# EAGLE design custom PCB rev2 (EAGLE 9.2.0)
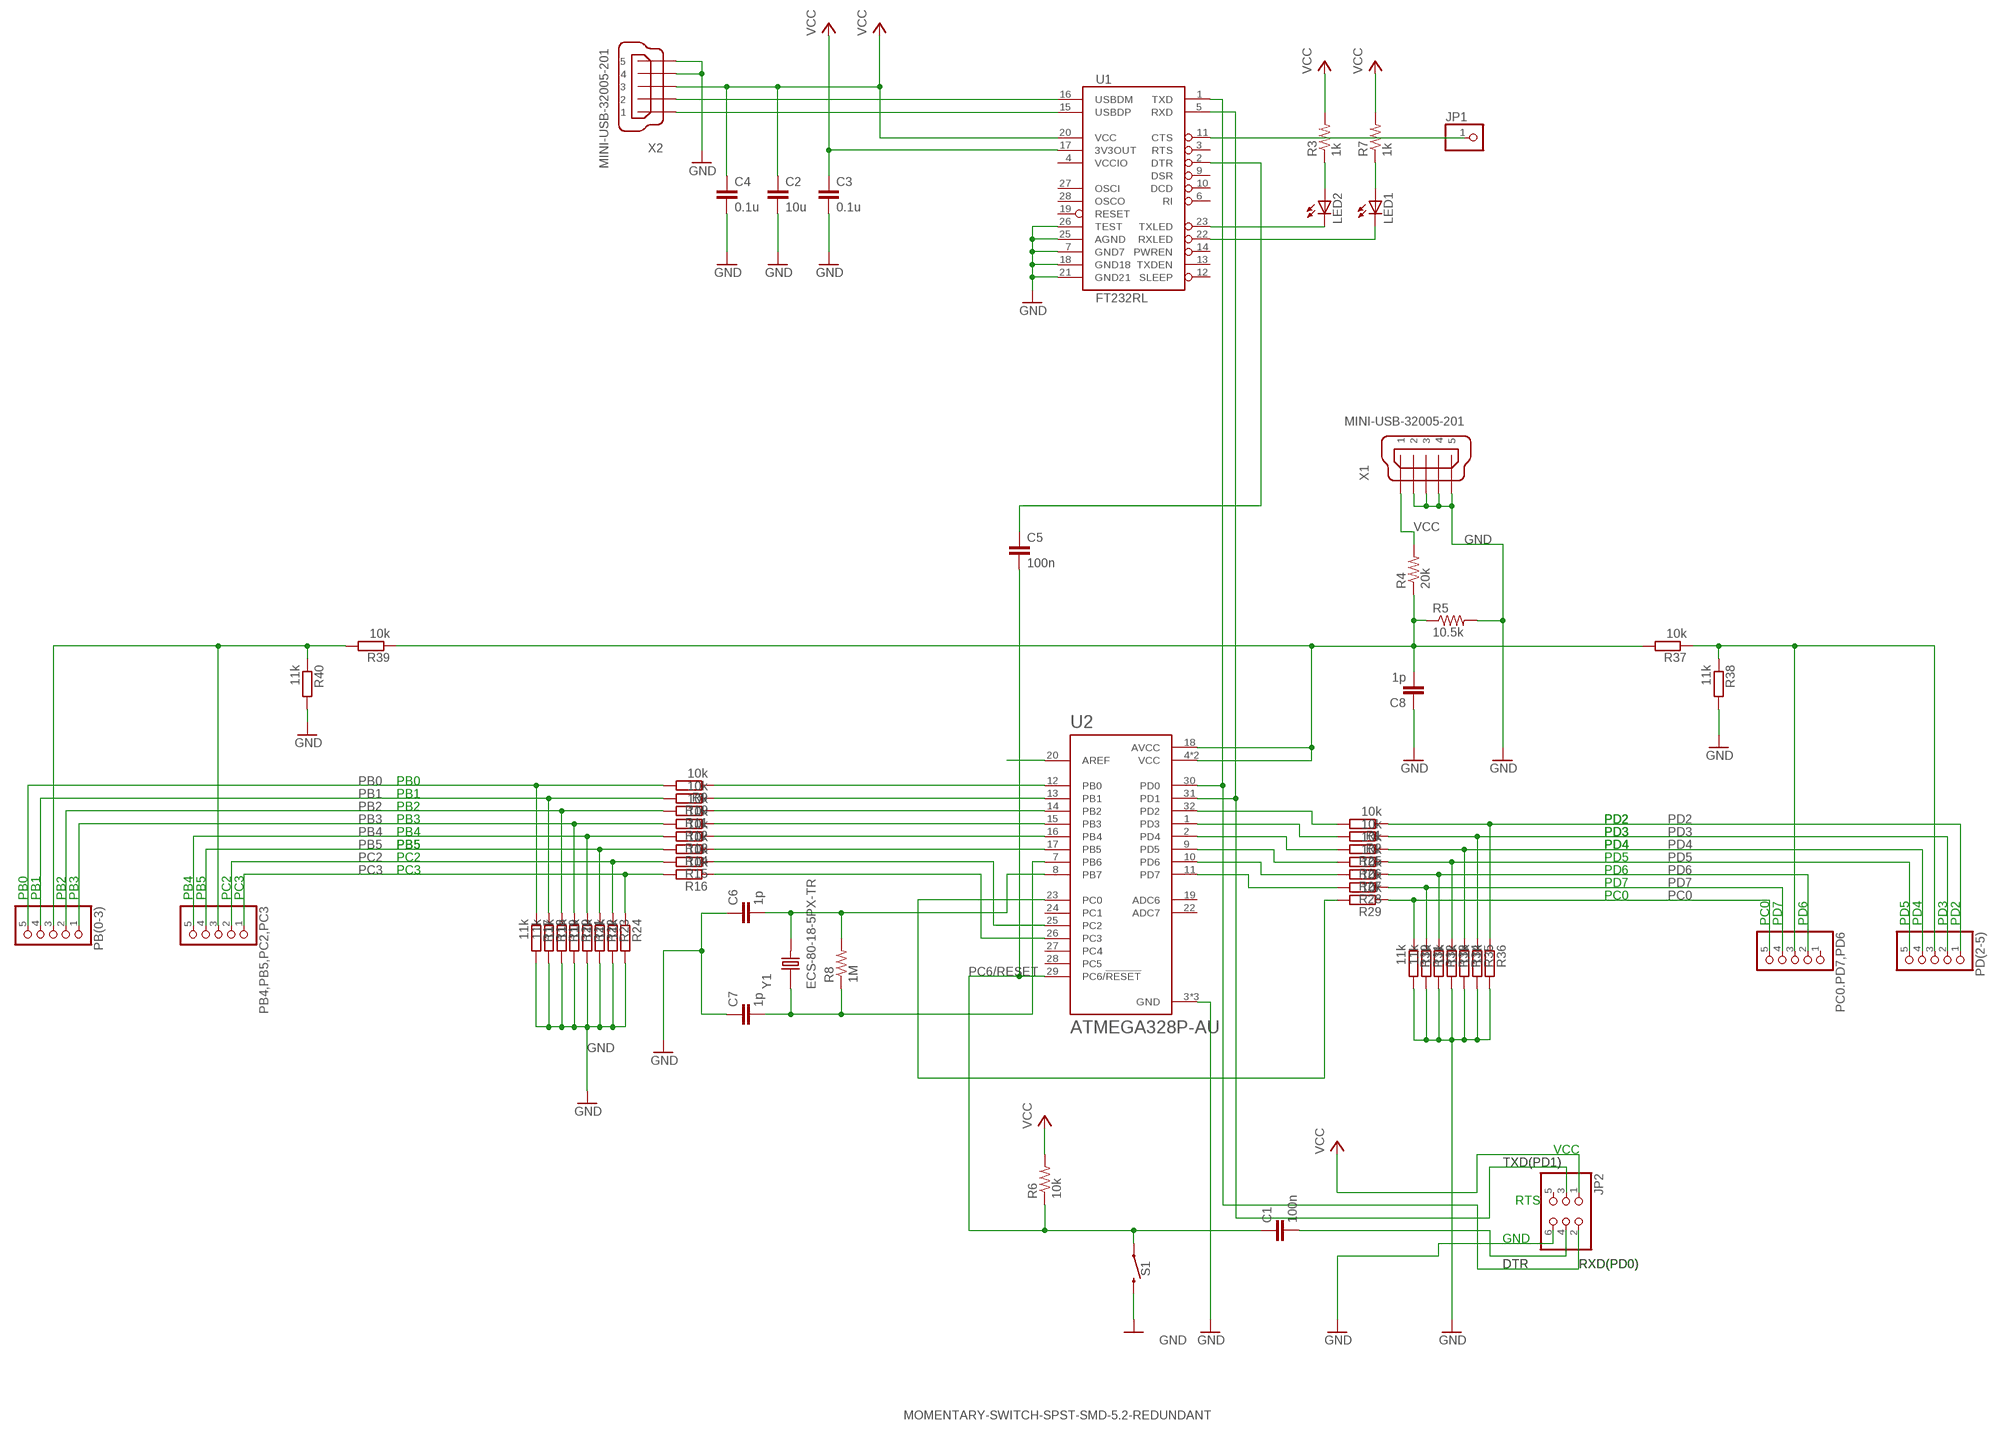
[diagram p0: schematic, sheet 1]

## Parts
C1  100n  C-EUC0603K  [C0603K]
C2  10u  C-EUC0603K  [C0603K]
C3  0.1u  C-EUC0603K  [C0603K]
C4  0.1u  C-EUC0603K  [C0603K]
C5  100n  C-EUC0603K  [C0603K]
C6  1p  C-EUC0603K  [C0603K]
C7  1p  C-EUC0603K  [C0603K]
C8  1p  C-EUC0603K  [C0603K]
JP1  PINHD-1X1  [1X01]
JP2  PINHD-2X3  [2X03]
LED1  LEDCHIP-LED0603  [CHIP-LED0603]
LED2  LEDCHIP-LED0603  [CHIP-LED0603]
PB4,PB5,PC2,PC3  PINHD-1X5  [1X05]
PB(0-3)  PINHD-1X5  [1X05]
PC0.PD7,PD6  PINHD-1X5  [1X05]
PD(2-5)  PINHD-1X5  [1X05]
R1  10k  RR0402  [R0402]
R2  10k  RR0402  [R0402]
R3  1k  R-US_R0603  [R0603]
R4  20k  R-US_R0603  [R0603]
R5  10.5k  R-US_R0603  [R0603]
R6  10k  R-US_R0603  [R0603]
R7  1k  R-US_R0603  [R0603]
R8  1M  R-US_R0603  [R0603]
R9  10k  RR0402  [R0402]
R10  10k  RR0402  [R0402]
R11  10k  RR0402  [R0402]
R12  10k  RR0402  [R0402]
R13  10k  RR0402  [R0402]
R14  10k  RR0402  [R0402]
R15  10k  RR0402  [R0402]
R16  10k  RR0402  [R0402]
R17  11k  RR0402  [R0402]
R18  11k  RR0402  [R0402]
R19  11k  RR0402  [R0402]
R20  11k  RR0402  [R0402]
R21  11k  RR0402  [R0402]
R22  11k  RR0402  [R0402]
R23  11k  RR0402  [R0402]
R24  11k  RR0402  [R0402]
R25  10k  RR0402  [R0402]
R26  10k  RR0402  [R0402]
R27  10k  RR0402  [R0402]
R28  10k  RR0402  [R0402]
R29  10k  RR0402  [R0402]
R30  11k  RR0402  [R0402]
R31  11k  RR0402  [R0402]
R32  11k  RR0402  [R0402]
R33  11k  RR0402  [R0402]
R34  11k  RR0402  [R0402]
R35  11k  RR0402  [R0402]
R36  11k  RR0402  [R0402]
R37  10k  RR0402  [R0402]
R38  11k  RR0402  [R0402]
R39  10k  RR0402  [R0402]
R40  11k  RR0402  [R0402]
S1  MOMENTARY-SWITCH-SPST-SMD-5.2-REDUNDANT  [TACTILE_SWITCH_SMD_5.2MM]
U1  FT232RL  FT232RLSSOP  [SSOP28DB]
U2  ATMEGA328P-AU  [QFP80P900X900X120-32N]
X1  MINI-USB-32005-201  [32005-201]
X2  MINI-USB-32005-201  [32005-201]
Y1  ECS-80-18-5PX-TR  [XTAL_ECS-80-18-5PX-TR]

## Nets
DTR: C1.2 JP2.4
GND: C2.2 C3.2 C4.2 C8.1 JP2.6 R5.2 R17.2 R18.2 R19.2 R20.2 R21.2 R22.2 R23.2 R24.2 R30.2 R31.2 R32.2 R33.2 R34.2 R35.2 R36.2 R38.2 R40.2 S1.3 S1.4 U1.7(GND7) U1.18(GND18) U1.21(GND21) U1.25(AGND) U1.26(TEST) U2.3(GND) U2.5(GND) U2.21(GND) X1.2 X1.3 X1.4 X1.5 X2.4 X2.5
N$1: R9.1 U2.12(PB0)
N$2: R10.1 U2.13(PB1)
N$3: R11.1 U2.14(PB2)
N$4: R12.1 U2.15(PB3)
N$5: R13.1 U2.16(PB4)
N$6: R14.1 U2.17(PB5)
N$7: R15.1 U2.25(PC2)
N$8: R16.1 U2.26(PC3)
N$9: PC0.PD7,PD6.3 PD(2-5).3 R37.1 R38.1
N$10: PB4,PB5,PC2,PC3.3 PB(0-3).3 R39.2 R40.1
N$11: JP1.1 U1.11(CTS)
N$17: R1.2 U2.32(PD2)
N$18: R2.2 U2.1(PD3)
N$19: R25.2 U2.2(PD4)
N$20: R26.2 U2.9(PD5)
N$21: R27.2 U2.10(PD6)
N$22: R28.2 U2.11(PD7)
N$23: R29.2 U2.23(PC0)
N$34: C8.2 R4.1 R5.1 R37.2 R39.1 U2.4(VCC) U2.6(VCC) U2.18(AVCC)
N$36: U2.20(AREF)
N$37: U1.15(USBDP) X2.1
N$38: U1.16(USBDM) X2.2
N$39: LED2.A R3.1
N$40: LED1.A R7.1
N$41: LED2.C U1.23(TXLED)
N$42: LED1.C U1.22(RXLED)
N$43: C6.2 R8.2 U2.8(PB7) Y1.2
N$44: C7.2 R8.1 U2.7(PB6) Y1.1
N$45: C5.1 U1.2(DTR)
N$46: C6.1 C7.1 ; supply symbol labelled GND
PB0: PB(0-3).5 R9.2 R17.1
PB1: PB(0-3).4 R10.2 R18.1
PB2: PB(0-3).2 R11.2 R19.1
PB3: PB(0-3).1 R12.2 R20.1
PB4: PB4,PB5,PC2,PC3.5 R13.2 R21.1
PB5: PB4,PB5,PC2,PC3.4 R14.2 R22.1
PC0: PC0.PD7,PD6.5 R29.1 R30.1
PC2: PB4,PB5,PC2,PC3.2 R15.2 R23.1
PC3: PB4,PB5,PC2,PC3.1 R16.2 R24.1
PC6/RESET: C1.1 C5.2 R6.1 S1.1 S1.2 U2.29(PC6/!RESET)
PD2: PD(2-5).1 R1.1 R36.1
PD3: PD(2-5).2 R2.1 R35.1
PD4: PD(2-5).4 R25.1 R34.1
PD5: PD(2-5).5 R26.1 R33.1
PD6: PC0.PD7,PD6.2 R27.1 R32.1
PD7: PC0.PD7,PD6.4 R28.1 R31.1
RXD(PD0): JP2.2 U1.1(TXD) U2.30(PD0)
TXD(PD1): JP2.3 U1.5(RXD) U2.31(PD1)
VCC: C2.1 C3.1 C4.1 JP2.1 R3.2 R4.2 R6.2 R7.2 U1.17(3V3OUT) U1.20(VCC) X1.1 X2.3
Unconnected: JP2.5 PC0.PD7,PD6.1 U1.3(RTS) U1.6(RI) U1.9(DSR) U1.10(DCD) U1.12(SLEEP) U1.13(TXDEN) U1.14(PWREN) U1.19(RESET) U1.27(OSCI) U1.28(OSCO) U2.19(ADC6) U2.22(ADC7) U2.24(PC1) U2.27(PC4) U2.28(PC5)

## Notes on the sheet
- PB0
- PB1
- PB2
- PB3 | PD2 | PD2
- PB4 | PD3 | PD3
- PB5 | PB5 | PD4 | PD4
- PC2 | PD5
- PC3 | PD6
- PD7
- PB0 | PB1 | PB2 | PB3 | PB4 | PB5 | PC2 | PC3 | PC0
- PC0 | PD7 | PD6 | PD5 | PD4 | PD3 | PD2
- VCC
- TXD(PD1)
- RTS
- GND
- DTR | RXD(PD0)

## Power pins joined to a net without a drawn wire
VCCIO: U1.4(VCCIO)

## Library data of the parts
C1-C8 = rcl:C-EU: CAPACITOR, European symbol; SPICEPREFIX: C
JP1 = pinhead:PINHD-1X1: PIN HEADER; SPICEPREFIX: X
JP2 = pinhead:PINHD-2X3: PIN HEADER; SPICEPREFIX: X
LED1 LED2 = led:LED: LED OSRAM: - CHIPLED LG R971, LG N971, LY N971, LG Q971, LY Q971, LO R971, LY R971 LH N974, LH R974 LS Q976, LO Q976, LY Q976 LO Q996 - Hyper CHIPLED LW Q18S LB Q993, LB Q99A, LB R99A - SideLED LS A670, LO A670, LY A670, LG A670, LP A670 LB A673, LV A673, LT A673, LW A673 LH A674 LY A675 LS A676, LA A676, LO A676, LY A676, LW A676 LS A679, LY A679, LG A679 - Hyper Micro SIDELED® LS Y876, LA Y876, LO Y876, LY Y876 LT Y87S - SmartLED LW L88C, LW L88S LB L89C, LB L89S, LG L890 LS L89K, LO L89K, LY L89K LS L896, LA L896, LO L896, LY L896 - TOPLED LS T670, LO T670, LY T670, LG T670, LP T670 LSG T670, LSP T670, LSY T670, LOP T670, LYG T670 LG T671, LOG T671, LSG T671 LB T673, LV T673, LT T673, LW T673 LH T674 LS T676, LA T676, LO T676, LY T676, LB T676, LH T676, LSB T676, LW T676 LB T67C, LV T67C, LT T67C, LS T67K, LO T67K, LY T67K, LW E67C LS E67B, LA E67B, LO E67B, LY E67B, LB E67C, LV E67C, LT E67C LW T67C LS T679, LY T679, LG T679 LS T770, LO T770, LY T770, LG T770, LP T770 LB T773, LV T773, LT T773, LW T773 LH T774 LS E675, LA E675, LY E675, LS T675 LS T776, LA T776, LO T776, LY T776, LB T776 LHGB T686 LT T68C, LB T68C - Hyper Mini TOPLED® LB M676 - Mini TOPLED Santana® LG M470 LS M47K, LO M47K, LY M47K Source: http://www.osram.convergy.de LUXEON: - LUMILED® LXK2-PW12-R00, LXK2-PW12-S00, LXK2-PW14-U00, LXK2-PW14-V00 LXK2-PM12-R00, LXK2-PM12-S00, LXK2-PM14-U00 LXK2-PE12-Q00, LXK2-PE12-R00, LXK2-PE12-S00, LXK2-PE14-T00, LXK2-PE14-U00 LXK2-PB12-K00, LXK2-PB12-L00, LXK2-PB12-M00, LXK2-PB14-N00, LXK2-PB14-P00, LXK2-PB14-Q00 LXK2-PR12-L00, LXK2-PR12-M00, LXK2-PR14-Q00, LXK2-PR14-R00 LXK2-PD12-Q00, LXK2-PD12-R00, LXK2-PD12-S00 LXK2-PH12-R00, LXK2-PH12-S00 LXK2-PL12-P00, LXK2-PL12-Q00, LXK2-PL12-R00 Source: www.luxeon.com KINGBRIGHT: KA-3528ASYC Source: www.kingbright.com; SPICEPREFIX: L
PB4,PB5,PC2,PC3 PB(0-3) PC0.PD7,PD6 PD(2-5) = pinhead:PINHD-1X5: PIN HEADER; SPICEPREFIX: X
R1 R2 R9-R40 = eagle-ltspice:R: RESISTOR, European symbol; SPICEMODEL: NONE; SPICEPREFIX: R
R3-R8 = rcl:R-US_: RESISTOR, American symbol; SPICEPREFIX: R
S1 = SparkFun-Switches:MOMENTARY-SWITCH-SPST: Momentary Switch (Pushbutton) - SPST Normally-open (NO) SPST momentary switches (buttons, pushbuttons). Variants PTH-12MM - 12mm square, through-hole Momentary Pushbutton Switch - 12mm Square <https://www.sparkfun.com/products/9190> (COM-09190) PTH-6.0MM, PTH-6.0MM-KIT - 6.0mm square, through-hole Mini Pushbutton Switch <https://www.sparkfun.com/products/97> (COM-00097) KIT package intended for soldering kit's - only one side of pads' copper is exposed. PTH-RIGHT-ANGLE-KIT - Right-angle, through-hole Right Angle Tactile Button <https://www.sparkfun.com/products/10791> - Used on SparkFun BigTime Watch Kit <https://www.sparkfun.com/products/11734> SMD-12MM - 12mm square, surface-mount Tactile Button - SMD (12mm) <https://www.sparkfun.com/products/12993> (COM-12993) Used on SparkFun PicoBoard <https://www.sparkfun.com/products/11888> SMD-4.5MM - 4.5mm Square Trackball Switch Used on SparkFun Blackberry Trackballer Breakout <https://www.sparkfun.com/products/13169> SMD-4.6MMX2.8MM - 4.60mm x 2.80mm, surface mount Used on SparkFun SAMD21 Mini Breakout <https://www.sparkfun.com/products/13664> SMD-5.2MM, SMD-5.2-REDUNDANT - 5.2mm square, surface-mount Mini Pushbutton Switch - SMD <https://www.sparkfun.com/products/8720> (COM-08720) Used on Arduino Pro Mini <https://www.sparkfun.com/products/11114> REDUNDANT package connects both switch circuits together SMD-6.0X3.5MM - 6.0 x 3.5mm, surface mount Momentary Reset Switch SMD <https://www.sparkfun.com/products/8229> (COM-08229) SMD-6.2MM-TALL - 6.2mm square, surface mount Tactile Button - SMD (6mm) <https://www.sparkfun.com/products/12992> Used on SparkFun Digital Sandbox <https://www.sparkfun.com/products/12651> SMD-RIGHT-ANGLE - Right-angle, surface mount Used on SparkFun Block for Intel® Edison - Arduino <https://www.sparkfun.com/products/13036>; PROD_ID: SWCH-08247; SF_SKU: COM-08720; SPICEPREFIX: B
U1 = SparkFun-IC-Comms:FT232RL: FT232RL USB UART FT232RL 4th Generation USB UART (USB <-> Serial) Controller. Datasheet <http://www.sparkfun.com/datasheets/IC/FT232R_v104.pdf> SparkFun Products Component <https://www.sparkfun.com/products/650> (COM-00650) SparkFun RedBot Mainboard <https://www.sparkfun.com/products/12097> (ROB-12097) SparkFun FTDI Basic Breakout - 5V <https://www.sparkfun.com/products/9716> (DEV-09716) SparkFun FTDI Basic Breakout - 3.3V <https://www.sparkfun.com/products/9873> (DEV-09873) Bus Pirate - v3.6a <https://www.sparkfun.com/products/12942> (TOL-12942) SparkFun USB to Serial Breakout - FT232RL <https://www.sparkfun.com/products/12731> (BOB-12731) SparkFun PicoBoard <https://www.sparkfun.com/products/11888> (WIG-11888) SparkFun RFID USB Reader <https://www.sparkfun.com/products/9963> (SEN-09963) LilyPad FTDI Basic Breakout - 5V <https://www.sparkfun.com/products/10275> (DEV-10275) SparkFun Stepoko <https://www.sparkfun.com/products/13899> (ROB-13899); PROD_ID: IC-00870; SPICEPREFIX: X
U2 = ATMEGA328P-AU:ATMEGA328P-AU: ATmega Series 20 MHz 32 KB Flash 2 KB SRAM 8-Bit Microcontroller - TQFP-32; DESCRIPTION: Microcontroller Mcu, 8 Bit, Atmega, 20mhz, Tqfp-32; DIGI-KEY_PART_NUMBER: ATMEGA328P-AU-ND; DIGI-KEY_PURCHASE_URL: https://www.digikey.com/product-detail/en/microchip-technology/ATMEGA328P-AU/ATMEGA328P-AU-ND/1832260?utm_source=snapeda&utm_medium=aggregator&utm_campaign=symbol; MF: Microchip; MP: ATMEGA328P-AU; PACKAGE: TQFP-32 Microchip; SPICEPREFIX: X
X1 X2 = con-cypressindustries:MINI-USB-: MINI USB-B Conector Source: www.cypressindustries.com; OC_FARNELL: unknown; OC_NEWARK: unknown; SPICEPREFIX: X
Y1 = ECS-80-18-5PX-TR:ECS-80-18-5PX-TR: CRYSTAL SMD; DESCRIPTION: CSM-7XDN Series 8 MHz ±50 ppm 18 pF -40 to +85 °C Surface Mount Crystal; DIGI-KEY_PART_NUMBER: XC1271CT-ND; DIGI-KEY_PURCHASE_URL: https://www.digikey.com/product-detail/en/ecs-inc/ECS-80-18-5PX-TR/XC1271CT-ND/827735?utm_source=snapeda&utm_medium=aggregator&utm_campaign=symbol; MF: ECS Inc.; MP: ECS-80-18-5PX-TR; PACKAGE: HC49/US ECS International; SPICEPREFIX: B

## Board
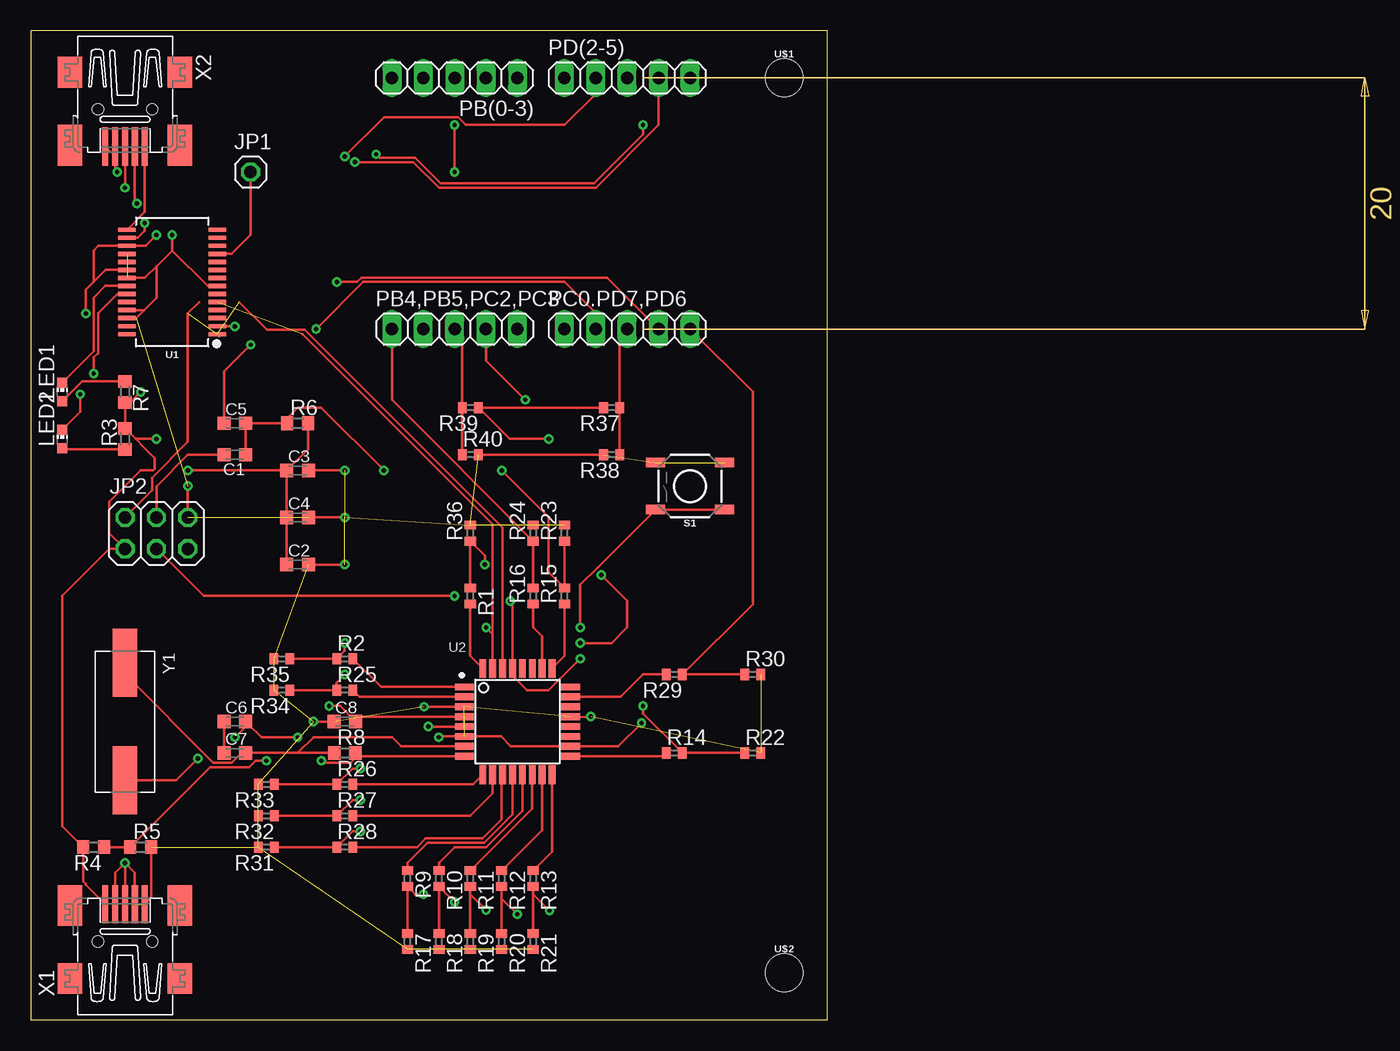
[diagram p1: board, top side]
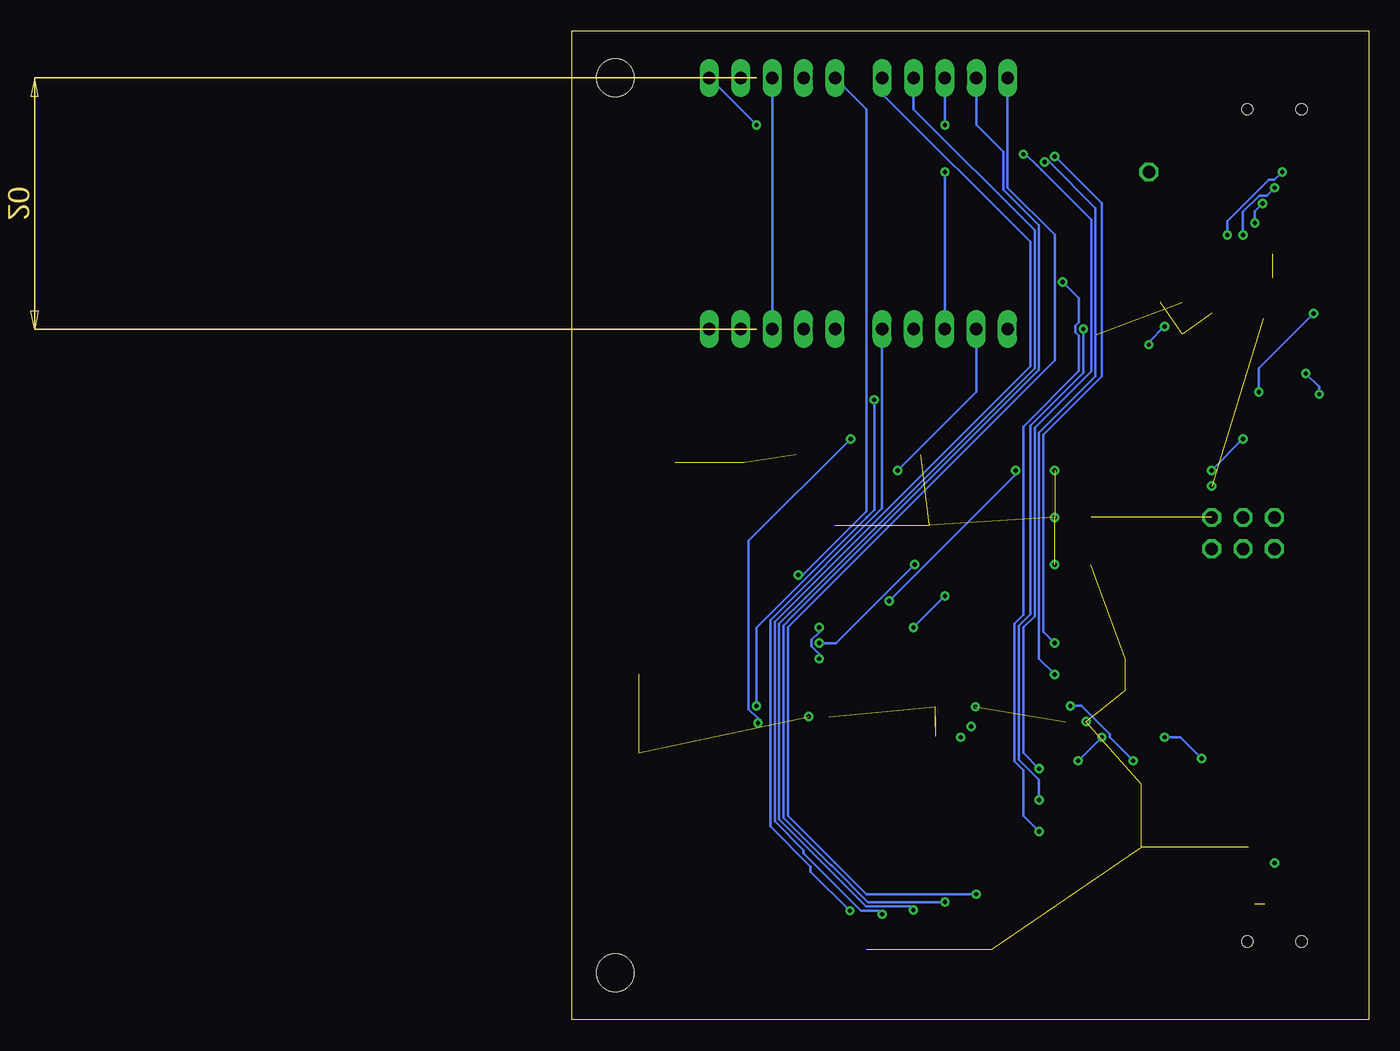
[diagram p2: board, bottom side, seen from below]

Size 64.44 x 80 mm. Coordinates in mm from the lower left corner, seen from the top.
Outline: 0,0 64.44,0 64.44,80 0,80 0,0
Copper layers (1*16): Top 0.035mm / dielectric 1.5mm / Bottom 0.035mm
Design rules "default": minimum track width 6mil, minimum drill 0.35mm, track to track 6mil, track to pad 6mil, pad to pad 6mil, via to via 6mil, smd to smd 6mil, copper to edge 40mil, drill to drill 6mil, minimum pad ring 10mil, minimum via ring 8mil, stop-mask expansion 4mil, vias tented up to drill 0mil, thermal gap 10mil

### Footprints (pad centres in the part's own frame; a part is rotated, then mirrored left to right if it is on the bottom)
C0603K = smd 1.05 x 1.08: 1 -0.875,0; 2 0.875,0
1X01 = drill 1.016 octagon: 1 0,0
2X03 = drill 1.016 octagon: 1 -2.54,-1.27; 2 -2.54,1.27; 3 0,-1.27; 4 0,1.27; 5 2.54,-1.27; 6 2.54,1.27
CHIP-LED0603 = smd 0.8 x 0.8: A 0,-0.75; C 0,0.75
1X05 = drill 1.016 long: 1 -5.08,0; 2 -2.54,0; 3 0,0; 4 2.54,0; 5 5.08,0
R0402 = smd 0.7 x 0.9: 1 -0.65,0; 2 0.65,0
R0603 = smd 1 x 1.1: 1 -0.85,0; 2 0.85,0
TACTILE_SWITCH_SMD_5.2MM = smd 1.524 x 0.762: 1 -2.794,1.905; 2 2.794,1.905; 3 -2.794,-1.905; 4 2.794,-1.905
SSOP28DB = smd 0.348 x 1.397: 1 -4.225,-3.656; 2 -3.575,-3.656; 3 -2.925,-3.656; 4 -2.275,-3.656; 5 -1.625,-3.656; 6 -0.975,-3.656; 7 -0.325,-3.656; 8 0.325,-3.656; 9 0.975,-3.656; 10 1.625,-3.656; 11 2.275,-3.656; 12 2.925,-3.656; 13 3.575,-3.656; 14 4.225,-3.656; 15 4.225,3.656; 16 3.575,3.656; 17 2.925,3.656; 18 2.275,3.656; 19 1.625,3.656; 20 0.975,3.656; 21 0.325,3.656; 22 -0.325,3.656; 23 -0.975,3.656; 24 -1.625,3.656; 25 -2.275,3.656; 26 -2.925,3.656; 27 -3.575,3.656; 28 -4.225,3.656
QFP80P900X900X120-32N = smd 1.5 x 0.55: 1 -4.3,2.8; 2 -4.3,2; 3 -4.3,1.2; 4 -4.3,0.4; 5 -4.3,-0.4; 6 -4.3,-1.2; 7 -4.3,-2; 8 -4.3,-2.8; 17 4.3,-2.8; 18 4.3,-2; 19 4.3,-1.2; 20 4.3,-0.4; 21 4.3,0.4; 22 4.3,1.2; 23 4.3,2; 24 4.3,2.8 | smd 0.55 x 1.5: 9 -2.8,-4.3; 10 -2,-4.3; 11 -1.2,-4.3; 12 -0.4,-4.3; 13 0.4,-4.3; 14 1.2,-4.3; 15 2,-4.3; 16 2.8,-4.3; 25 2.8,4.3; 26 2,4.3; 27 1.2,4.3; 28 0.4,4.3; 29 -0.4,4.3; 30 -1.2,4.3; 31 -2,4.3; 32 -2.8,4.3
STAND-OFF-TIGHT = hole 3.048: 0,0
32005-201 = smd 3.1 x 0.5: 1 3,1.6; 2 3,0.8; 3 3,0; 4 3,-0.8; 5 3,-1.6 | smd 2.5 x 2: M1 -3,-4.45; M2 -3,4.45 | smd 3.3 x 2: M3 2.9,4.45; M4 2.9,-4.45 | hole 0.9: 0,2.2; 0,-2.2
XTAL_ECS-80-18-5PX-TR = smd 5.5 x 2: 1 -4.75,0; 2 4.75,0

### Placement (x,y rotation side)
C1  16.51,45.72 180 top
C2  21.59,36.83 0 top
C3  21.59,44.45 0 top
C4  21.59,40.64 0 top
C5  16.51,48.26 0 top
C6  16.51,24.13 0 top
C7  16.51,21.59 0 top
C8  25.4,24.13 0 top
JP1  17.78,68.58 0 top
JP2  10.16,39.37 0 top
LED1  2.54,50.8 0 top
LED2  2.54,46.99 0 top
PB4,PB5,PC2,PC3  34.29,55.88 0 top
PB(0-3)  34.29,76.2 180 top
PC0.PD7,PD6  48.26,55.88 0 top
PD(2-5)  48.26,76.2 0 top
R1  35.56,34.29 270 top
R2  25.4,29.21 0 top
R3  7.62,46.99 90 top
R4  5.08,13.97 180 top
R5  8.89,13.97 0 top
R6  21.59,48.26 0 top
R7  7.62,50.8 270 top
R8  25.4,21.59 0 top
R9  30.48,11.43 270 top
R10  33.02,11.43 270 top
R11  35.56,11.43 270 top
R12  38.1,11.43 270 top
R13  40.64,11.43 270 top
R14  52.07,21.59 0 top
R15  43.18,34.29 90 top
R16  40.64,34.29 90 top
R17  30.48,6.35 270 top
R18  33.02,6.35 270 top
R19  35.56,6.35 270 top
R20  38.1,6.35 270 top
R21  40.64,6.35 270 top
R22  58.42,21.59 0 top
R23  43.18,39.37 90 top
R24  40.64,39.37 90 top
R25  25.4,26.67 0 top
R26  25.4,19.05 0 top
R27  25.4,16.51 0 top
R28  25.4,13.97 0 top
R29  52.07,27.94 180 top
R30  58.42,27.94 0 top
R31  19.05,13.97 180 top
R32  19.05,16.51 180 top
R33  19.05,19.05 180 top
R34  20.32,26.67 180 top
R35  20.32,29.21 180 top
R36  35.56,39.37 90 top
R37  46.99,49.53 180 top
R38  46.99,45.72 180 top
R39  35.56,49.53 180 top
R40  35.56,45.72 0 top
S1  53.34,43.18 180 top
U1  11.43,59.69 90 top
U2  39.37,24.13 0 top
U$1  [STAND-OFF-TIGHT]  60.96,76.2 0 top
U$2  [STAND-OFF-TIGHT]  60.96,3.81 0 top
X1  7.62,6.35 90 top
X2  7.62,73.66 270 top
Y1  7.62,24.13 270 top

### Tracks (layer width: path | path; a pad name or v marks a point on that pad's centre or on a via)
DTR
  Top 0.203: C1.2 12.7,45.72 10.16,43.18 JP2.4
GND  (via drill 0.35)  (29 unrouted)
  Top 0.152: U2.21 v45.32,24.53
  Top 0.203: U2.5 v32.15,23.73 | U2.3 v31.82,25.33 | C8.1 v22.86,24.13 | JP2.6 v12.7,43.18 | C4.2 v25.4,40.64 | C3.2 v25.4,44.45 | C2.2 v25.4,36.83 | X2.4 6.82,69.86 | 6.82,69.86 6.82,68.75 v6.99,68.58 | v11.43,63.5 11.43,62.23 | U1.21 9.21,60.02 10.16,60.96 | 11.43,62.23 10.16,60.96 | X2.5 6.82,69.86 | 11.43,62.23 14.29,59.37 U1.7 | 10.16,60.96 10.16,58.42 9.15,57.41 | 9.15,57.41 8.51,56.77 U1.26 | U1.25 9.15,57.41 | R5.2 9.74,9.87 X1.5 | X1.4 8.42,11.9 v7.62,12.7 | v7.62,12.7 6.82,11.9 X1.2 | X1.3 v7.62,12.7 | R38.2 R40.2
  Bottom 0.203: v6.99,68.58 7.63,67.94 8.08,67.94 11.43,64.59 v11.43,63.5
N$1
  Top 0.203: U2.12 38.97,16.61 36.68,14.33 32.11,14.33 30.48,12.7 R9.1
N$2
  Top 0.203: U2.13 39.77,16.91 36.83,13.97 34.29,13.97 33.02,12.7 R10.1
N$3
  Top 0.203: U2.14 40.57,17.09 R11.1
N$4
  Top 0.203: U2.15 41.37,15.35 R12.1
N$5
  Top 0.203: U2.16 42.17,13.61 R13.1
N$6
  Top 0.203: U2.17 51.16,21.33 R14.1
N$7
  Top 0.203: U2.25 43.18,29.44 R15.1
N$8
  Top 0.203: U2.26 41.37,31.02 40.64,31.75 R16.1
N$9
  Top 0.203: R38.1 R37.1 47.64,55.26 PC0.PD7,PD6.3
  Bottom 0.203: PD(2-5).3 PC0.PD7,PD6.3
N$10  (via drill 0.35)
  Top 0.203: R40.1 R39.2 34.91,55.26 PB4,PB5,PC2,PC3.3 | v34.29,72.39 v34.29,68.58
  Bottom 0.203: PB(0-3).3 v34.29,72.39 | v34.29,68.58 PB4,PB5,PC2,PC3.3
N$11
  Top 0.203: JP1.1 17.78,63.5 16.25,61.97 U1.11
N$17
  Top 0.203: U2.32 35.56,29.44 R1.2
N$18
  Top 0.203: U2.1 28.33,26.93 R2.2
N$19
  Top 0.203: U2.2 26.59,26.13 R25.2
N$20
  Top 0.203: U2.9 35.79,19.05 R26.2
N$21
  Top 0.203: U2.10 37.37,18.32 35.56,16.51 R27.2
N$22
  Top 0.203: U2.11 38.1,19.76 38.1,16.25 36.53,14.68 31.96,14.68 31.25,13.97 R28.2
N$23
  Top 0.203: U2.23 47.72,26.13 49.53,27.94 R29.2
N$34  (via drill 0.35)  (1 unrouted)
  Top 0.203: U2.4 26.68,24.53 C8.2 25,25.4 v24.13,25.4 | R4.1 R5.1 14.51,20.44 17.66,20.44 18.18,20.96 v19.05,20.96 | v33.02,22.86 33.09,22.93 U2.6 38.03,22.93 38.83,22.13 U2.18 47.53,22.13 v49.41,24.01 | R37.2 R39.1 38.75,46.99 v41.91,46.99
  Bottom 0.203: v19.05,20.96 20.96,22.87 20.96,23.12 23.24,25.4 v24.13,25.4 | v49.41,24.01 49.41,24.38 50.16,25.14 50.16,38.74 v41.91,46.99
N$37
  Top 0.203: X2.1 9.22,65.36 U1.15
N$38  (via drill 0.35)
  Top 0.203: X2.2 8.42,66.21 v8.59,66.04 | 8.36,63.27 U1.16 8.65,63.27 9.21,63.82 v9.21,64.45
  Bottom 0.203: v8.59,66.04 9.21,65.42 v9.21,64.45
N$39
  Top 0.203: LED2.A 2.64,46.14 R3.1
N$40
  Top 0.203: LED1.A 4.14,51.65 R7.1
N$41  (via drill 0.35)
  Top 0.203: LED2.C 4,49.2 v4,50.61 | v5.08,52.28 5.08,53.59 5.44,53.94 5.44,57.15 7,58.72 U1.23
  Bottom 0.203: v4,50.61 4,51.2 v5.08,52.28
N$42
  Top 0.203: LED1.C 5.08,54.09 5.08,58.42 6.03,59.37 U1.22
N$43  (via drill 0.35)
  Top 0.152: 26.46,21.38 R8.2
  Top 0.203: U2.8 26.51,21.33 26.46,21.38 25.87,20.79 23.95,20.79 23.77,20.96 v23.52,20.96 | C6.2 17.58,23.93 | 17.58,23.93 18.66,22.86 v21.59,22.86 | Y1.2 11.76,19.38 v13.52,21.14 | v16.51,22.86 17.58,23.93
  Bottom 0.203: v21.59,22.86 23.49,20.96 v23.52,20.96 | v13.52,21.14 15.24,22.86 v16.51,22.86
N$44
  Top 0.203: U2.7 29.94,22.13 29.21,22.86 22.86,22.86 21.59,21.59 | 21.59,21.59 C7.2 17.06,21.59 16.27,20.8 14.76,20.8 7.62,27.94 Y1.1 | R8.1 21.59,21.59
N$45  (via drill 0.35)
  Top 0.203: U1.2 15.1,56.1 v16.51,56.1 | C5.1 15.63,52.47 v17.78,54.61
  Bottom 0.203: v17.78,54.61 17.78,54.83 v16.51,56.1
N$46
  Top 0.203: C7.1 C6.1
PB0  (via drill 0.35)
  Top 0.203: R17.1 R9.2 31.1,10.16 v31.75,10.16
  Bottom 0.203: v31.75,10.16 40.64,10.16 43.18,12.7 46.99,16.51 46.99,31.75 25.4,53.34 25.4,63.5 29.21,67.31 PB(0-3).5
PB1  (via drill 0.35)
  Top 0.203: R18.1 R10.2 34.27,9.53 v34.29,9.53
  Bottom 0.203: v34.29,9.53 40.51,9.53 43.43,12.45 43.54,12.55 47.35,16.36 47.35,31.9 46.61,32.64 26.67,52.57 26.67,64.27 29.57,67.16 29.57,70.21 31.75,72.39 PB(0-3).4
PB2  (via drill 0.35)
  Top 0.203: R19.1 R11.2 35.56,10.16 v36.83,8.89
  Bottom 0.203: v36.83,8.89 37.11,9.17 40.66,9.17 47.7,16.21 47.7,32.05 45.59,34.16 27.03,52.72 27.03,63.86 36.83,73.66 PB(0-3).2
PB3  (via drill 0.35)
  Top 0.203: R20.1 R12.2 38.1,9.81 v39.37,8.54
  Bottom 0.203: v39.37,8.54 39.65,8.82 41.07,8.82 45.72,13.47 45.72,13.73 48.06,16.07 48.06,32.19 27.38,52.87 27.38,62.94 39.37,74.93 PB(0-3).1
PB4  (via drill 0.35)
  Top 0.203: R21.1 R13.2 40.64,10.16 v41.97,8.83
  Bottom 0.203: v41.97,8.83 45.15,12 | 45.15,12 45.16,12.01 | 45.15,12 45.15,12.39 48.41,15.66 48.41,32.34 39.37,41.38 PB4,PB5,PC2,PC3.5
PB5  (via drill 0.35)
  Top 0.203: R22.1 R14.2 49.53,24.78 v49.53,25.4 | v40,50.16 36.83,53.33 PB4,PB5,PC2,PC3.4
  Bottom 0.203: v49.53,25.4 49.53,31.72 40.64,40.61 40.64,40.64 40.61,40.64 39.99,41.26 v39.99,50.15 v40,50.16
PC0
  Top 0.203: R30.1 R29.1 58.42,33.64 58.42,50.8 PC0.PD7,PD6.5
PC2  (via drill 0.35)
  Top 0.203: R23.1 R15.2 41.91,36.21 41.91,40.64 v38.1,44.45
  Bottom 0.203: v38.1,44.45 31.75,50.8 PB4,PB5,PC2,PC3.2
PC3
  Top 0.203: R16.2 R24.1 29.21,50.15 PB4,PB5,PC2,PC3.1
PC6/RESET  (via drill 0.35)
  Top 0.203: R6.1 20.32,48.26 | 20.32,48.26 C5.2 C1.1 | v44.45,31.75 44.45,35.18 45.89,36.63 45.9,36.63 S1.2 S1.1 | v44.45,29.21 41.91,26.67 40.15,26.67 38.97,27.85 U2.29 38.97,33.7 v38.8,33.87 | v28.57,44.45 23.49,49.53 21.59,49.53 20.32,48.26
  Bottom 0.203: v44.45,31.75 44.45,31.37 45.08,30.74 45.08,30.22 44.45,29.59 v44.45,29.21 | v38.8,33.87 28.57,44.1 v28.57,44.45
PD2  (via drill 0.35)
  Top 0.203: R1.1 R36.1 36.74,37.54 v36.74,36.83 | v46.15,35.99 48.26,33.89 48.26,31.75 46.99,30.48 v44.45,30.48
  Bottom 0.203: PD(2-5).1 40.64,73.66 40.64,41.14 45.79,35.99 v46.15,35.99 | v44.45,30.48 43.09,30.48 v36.74,36.83
PD3  (via drill 0.35)
  Top 0.203: R35.1 R2.1 25.4,29.86 v25.4,30.48 | v25.4,69.85 28.57,73.02 34.55,73.02 35.18,72.39 43.18,72.39 45.72,74.93 PD(2-5).2
  Bottom 0.203: v25.4,30.48 26.31,31.39 26.31,47.35 21.59,52.07 21.59,66.04 v25.4,69.85
PD4  (via drill 0.35)
  Top 0.203: R34.1 R25.1 24.75,27.29 v25.4,27.94 | v26.23,69.39 30.94,69.39 33.02,67.31 45.72,67.31 50.8,72.39 PD(2-5).4
  Bottom 0.203: v25.4,27.94 26.67,29.21 26.67,47.49 22.09,52.07 22.09,65.65 25.85,69.4 | 25.85,69.4 26.03,69.59 | 25.85,69.4 26.22,69.4 v26.23,69.39
PD5  (via drill 0.35)
  Top 0.203: R33.1 R26.1 26.02,20.32 v26.67,20.32 | v27.94,70.03 28.22,69.75 31.09,69.75 33.17,67.67 45.57,67.67 49.53,71.62 v49.53,72.39
  Bottom 0.203: v26.67,20.32 27.94,21.59 27.94,31.75 27.03,32.66 27.03,47.9 22.45,52.48 22.45,64.72 26.49,68.76 26.86,69.13 27.75,70.03 v27.94,70.03 | v49.53,72.39 PD(2-5).5
PD6  (via drill 0.35)
  Top 0.203: R32.1 R27.1 26.02,17.78 v26.67,17.78 | v23.08,55.88 26.89,59.69 43.18,59.69 45.72,57.15 PC0.PD7,PD6.2
  Bottom 0.203: v26.67,17.78 26.67,19.43 28.3,21.05 28.3,31.9 27.38,32.81 27.38,48.05 23.08,52.35 v23.08,55.88
PD7  (via drill 0.35)
  Top 0.203: R31.1 R28.1 26.02,15.24 v26.67,15.24 | v24.77,59.69 26.39,59.69 26.74,60.05 46.63,60.05 PC0.PD7,PD6.4
  Bottom 0.203: v26.67,15.24 27.94,16.51 27.94,20.19 28.65,20.9 28.65,32.05 27.94,32.76 27.94,48 23.44,52.5 23.44,55.34 23.71,55.62 23.71,56.14 23.44,56.42 23.44,58.36 v24.77,59.69
RXD(PD0)  (2 unrouted)
  Top 0.203: JP2.2 9.8,42.82 9.8,43.85 12.7,46.75 12.7,57.15 13.62,58.06 | U2.30 38.17,39.8 22.15,55.82 19.11,55.82 16.86,58.06 | 15.24,55.31 U1.1
TXD(PD1)  (via drill 0.35)  (1 unrouted)
  Top 0.203: U2.31 37.37,30.48 37.37,31.21 | 37.37,31.21 37.37,40.1 22,55.47 | JP2.3 13.97,34.29 v34.29,34.29 | v36.83,31.75 37.37,31.21
  Bottom 0.203: v34.29,34.29 v36.83,31.75
VCC  (via drill 0.35)
  Top 0.203: R6.2 22.44,46.17 C3.1 | C2.1 C4.1 C3.1 | R3.2 10.03,45.43 10.03,44.58 9.9,44.45 8.89,44.45 6.35,41.91 6.35,39.37 JP2.1 6.35,38.1 2.54,34.29 2.54,15.66 R4.2 4.23,11.2 4.42,11.01 4.42,10.95 X1.1 | C3.1 v12.7,44.45 | v10.16,46.99 8.47,46.99 R3.2 | R3.2 7.62,49.53 | 7.62,49.53 R7.2 | X2.3 v7.62,67.31 | v10.16,63.5 9.28,62.62 U1.17 5.46,62.62 5.08,62.23 5.08,59.69 | U1.20 6.05,60.66 5.08,59.69 | 5.08,59.69 4.45,59.06 v4.45,57.15 | v8.89,50.8 7.62,49.53
  Bottom 0.203: v12.7,44.45 v10.16,46.99 | v7.62,67.31 8.26,66.67 8.85,66.67 10.16,65.36 v10.16,63.5 | v4.45,57.15 8.89,52.71 v8.89,50.8

### Text on the board
tStop: ECEN 2440 PCB Rev 2 | Alex Burg Carson Syberg